# EAGLE design XTIDE-CPLD-3V3-v2_alt_routing (EAGLE 5.07)
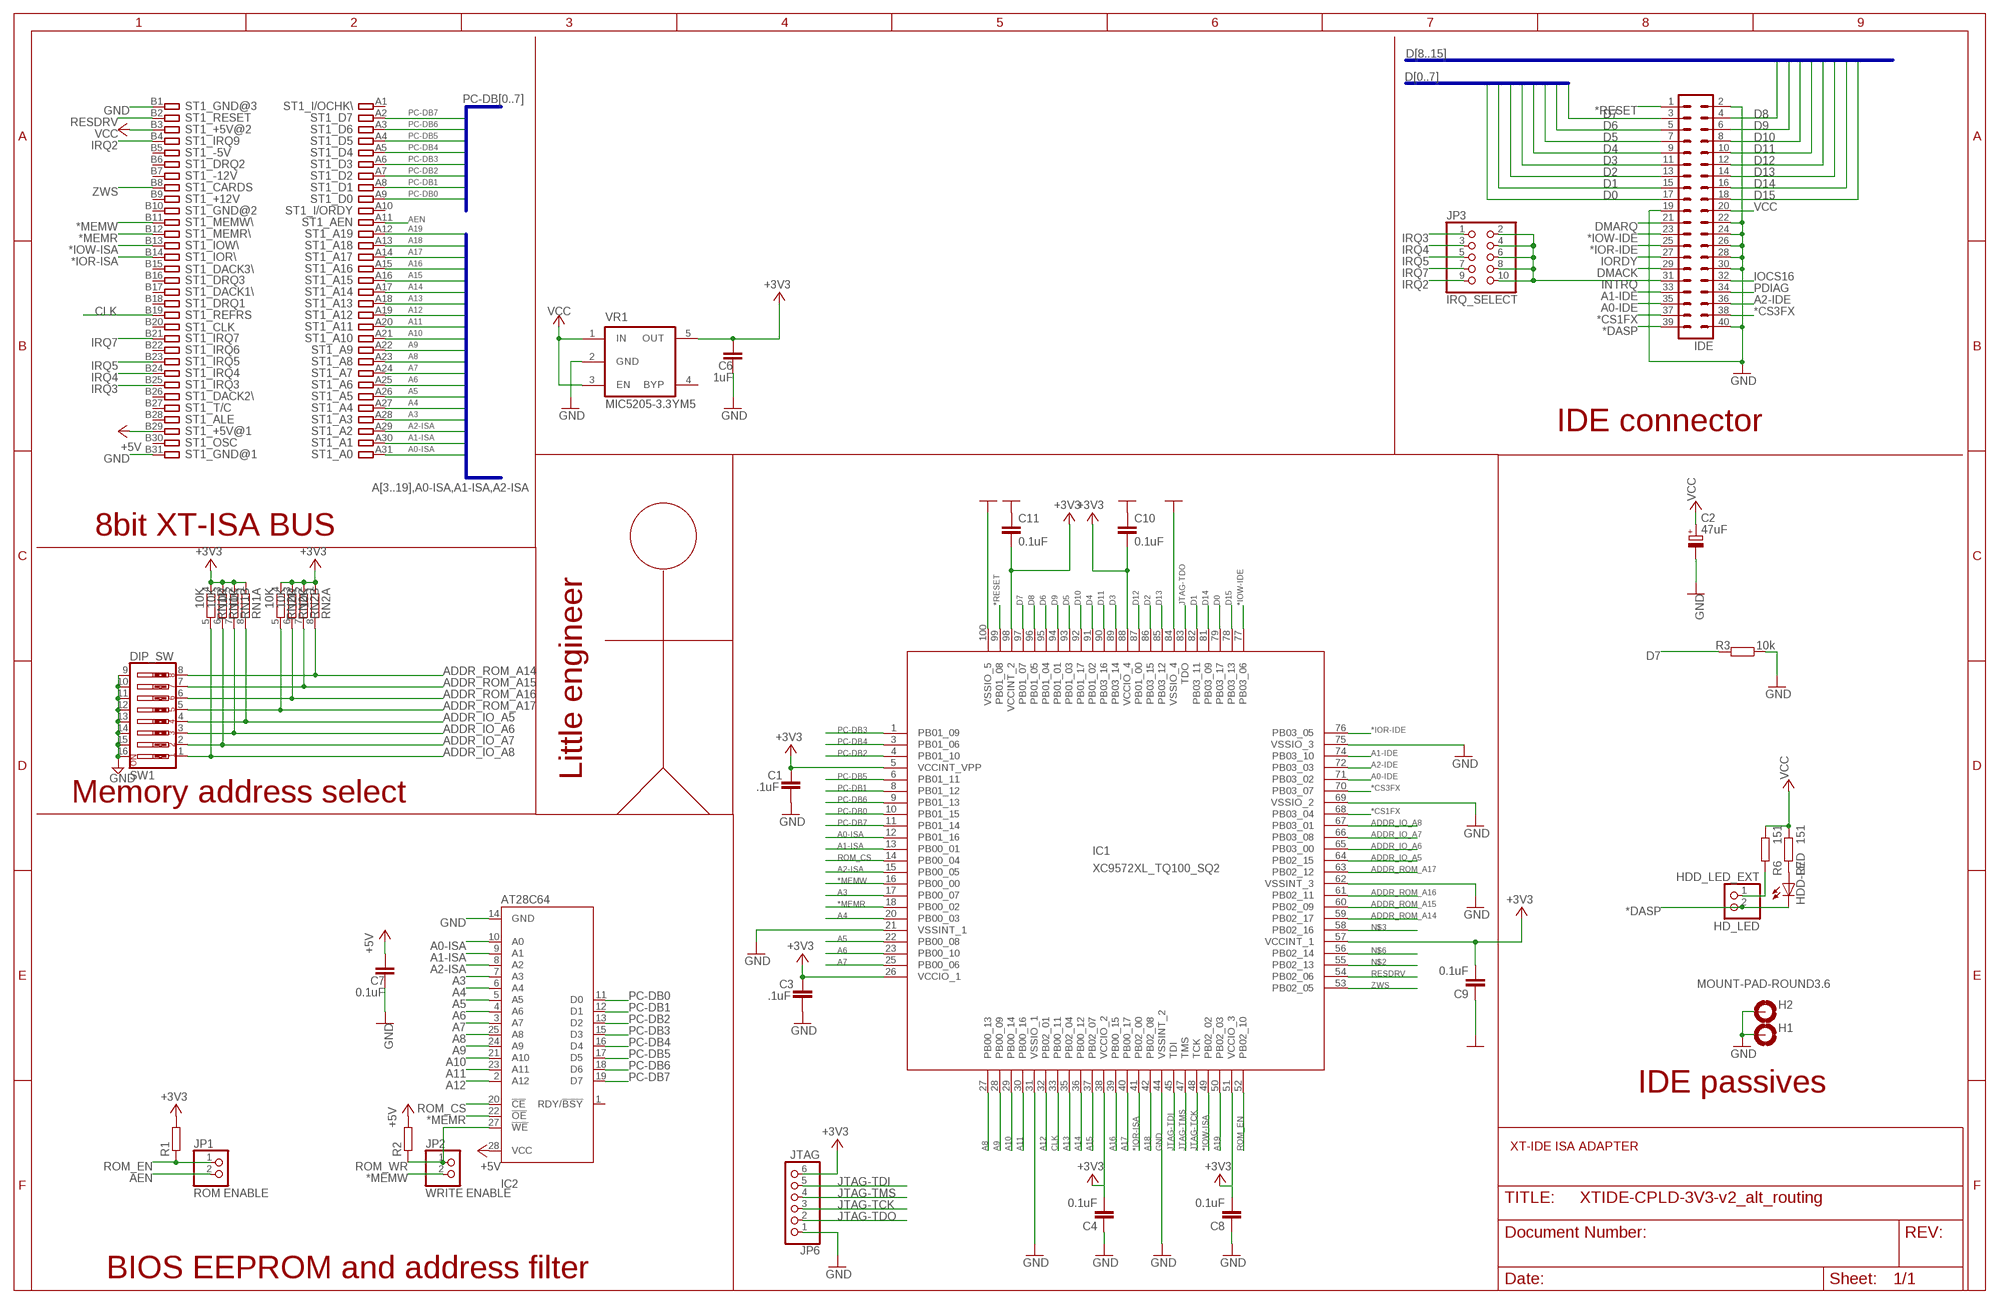
[diagram p0: schematic, sheet 1]

## Parts
C1  .1uF  C-EUC0603  [C0603]
C2  47uF  CPOL-EUSANYO_SMD_A5  [SANYO-OSCON_SMD_A5]
C3  .1uF  C-EUC0603  [C0603]
C4  0.1uF  C-EUC0603  [C0603]
C6  1uF  C-EUC0603  [C0603]
C7  0.1uF  C-EUC0603  [C0603]
C8  0.1uF  C-EUC0603  [C0603]
C9  0.1uF  C-EUC0603  [C0603]
C10  0.1uF  C-EUC0603  [C0603]
C11  0.1uF  C-EUC0603  [C0603]
DIP_SW  SW1  SW_DIP-8  [EDG-08]
H1  MOUNT-PAD-ROUND3.6  [3,6-PAD]
H2  MOUNT-PAD-ROUND3.6  [3,6-PAD]
HDD-LED  LEDCHIPLED_0805  [CHIPLED_0805]
HDD_LED_EXT  HD_LED  PINHD-1X02_2.54-S  [1X02-S]
IC1  XC9572XL_TQ100_SQ2  [VQ100]
IC2  AT28C64  28C64AP  [DIL28-6]
IDE  MA20-2  [MA20-2]
JP1  ROM ENABLE  PINHD-1X02_2.54-S  [1X02-S]
JP2  WRITE ENABLE  PINHD-1X02_2.54-S  [1X02-S]
JP3  IRQ_SELECT  PINHD-2X05_2.54  [2X05]
JP6  JTAG  PINHD-1X06_2.54-S  [1X06-S]
R1  R-EU_R0603  [R0603]
R2  R-EU_R0603  [R0603]
R3  10k  R-EU_R0603  [R0603]
R6  151  R-EU_R0603  [R0603]
R7  151  R-EU_R0603  [R0603]
RN1  10K  RNETWORK  [RN8P-4R-CRA06S]
RN2  10K  RNETWORK  [RN8P-4R-CRA06S]
ST1  IBM8BIT  [IBM8BIT]
VR1  MIC5205-3.3YM5  MIC5205  [SOT-23-5]

## Nets
*CS1FX: IC1.68(PB03_04) IDE.37
*CS3FX: IC1.70(PB03_07) IDE.38
*DASP: HDD-LED.C HDD_LED_EXT.2 IDE.39
*IOR-IDE: IC1.76(PB03_05) IDE.25
*IOR-ISA: IC1.41(PB02_00) ST1.B14
*IOW-IDE: IC1.77(PB03_06) IDE.23
*IOW-ISA: IC1.49(PB02_02) ST1.B13
*MEMR: IC1.18(PB00_02) IC2.22(!OE) ST1.B12
*MEMW: IC1.16(PB00_00) JP2.2 ST1.B11
*RESET: IC1.99(PB01_08) IDE.1
+3V3: C1.2 C3.2 C4.2 C6.2 C8.2 C9.2 C10.2 C11.2 IC1.5(VCCINT_VPP) IC1.26(VCCIO_1) IC1.38(VCCIO_2) IC1.51(VCCIO_3) IC1.57(VCCINT_1) IC1.88(VCCIO_4) IC1.98(VCCINT_2) JP6.6 R1.2 RN1.1 RN1.2 RN1.3 RN1.4 RN2.1 RN2.2 RN2.3 RN2.4 VR1.5(OUT)
+5V: C7.2 IC2.28(VCC) R2.2 ST1.B29
A0-IDE: IC1.71(PB03_02) IDE.35
A0-ISA: IC1.12(PB01_16) IC2.10(A0) ST1.A31
A1-IDE: IC1.74(PB03_10) IDE.33
A1-ISA: IC1.13(PB00_01) IC2.9(A1) ST1.A30
A2-IDE: IC1.72(PB03_03) IDE.36
A2-ISA: IC1.15(PB00_05) IC2.8(A2) ST1.A29
A3: IC1.17(PB00_07) IC2.7(A3) ST1.A28
A4: IC1.20(PB00_03) IC2.6(A4) ST1.A27
A5: IC1.22(PB00_08) IC2.5(A5) ST1.A26
A6: IC1.23(PB00_10) IC2.4(A6) ST1.A25
A7: IC1.25(PB00_06) IC2.3(A7) ST1.A24
A8: IC1.27(PB00_13) IC2.25(A8) ST1.A23
A9: IC1.28(PB00_09) IC2.24(A9) ST1.A22
A10: IC1.29(PB00_14) IC2.21(A10) ST1.A21
A11: IC1.30(PB00_16) IC2.23(A11) ST1.A20
A12: IC1.32(PB02_01) IC2.2(A12) ST1.A19
A13: IC1.35(PB02_04) ST1.A18
A14: IC1.36(PB00_12) ST1.A17
A15: IC1.37(PB02_07) ST1.A16
A16: IC1.39(PB00_15) ST1.A15
A17: IC1.40(PB00_17) ST1.A14
A18: IC1.42(PB02_08) ST1.A13
A19: IC1.50(PB02_03) ST1.A12
ADDR_IO_A5: DIP_SW.4 IC1.64(PB02_15) RN1.8
ADDR_IO_A6: DIP_SW.3 IC1.65(PB03_00) RN1.7
ADDR_IO_A7: DIP_SW.2 IC1.66(PB03_08) RN1.6
ADDR_IO_A8: DIP_SW.1 IC1.67(PB03_01) RN1.5
ADDR_ROM_A14: DIP_SW.8 IC1.59(PB02_17) RN2.8
ADDR_ROM_A15: DIP_SW.7 IC1.60(PB02_09) RN2.7
ADDR_ROM_A16: DIP_SW.6 IC1.61(PB02_11) RN2.6
ADDR_ROM_A17: DIP_SW.5 IC1.63(PB02_12) RN2.5
AEN: JP1.2 ST1.A11
CLK: IC1.33(PB00_11) ST1.B19
D0: IC1.79(PB03_17) IDE.17
D1: IC1.82(PB03_11) IDE.15
D2: IC1.86(PB03_15) IDE.13
D3: IC1.89(PB03_14) IDE.11
D4: IC1.91(PB01_02) IDE.9
D5: IC1.93(PB01_03) IDE.7
D6: IC1.95(PB01_04) IDE.5
D7: IC1.97(PB01_07) IDE.3 R3.2
D8: IC1.96(PB01_05) IDE.4
D9: IC1.94(PB01_01) IDE.6
D10: IC1.92(PB01_17) IDE.8
D11: IC1.90(PB03_16) IDE.10
D12: IC1.87(PB01_00) IDE.12
D13: IC1.85(PB03_12) IDE.14
D14: IC1.81(PB03_09) IDE.16
D15: IC1.78(PB03_13) IDE.18
DMACK: IDE.29
DMARQ: IDE.21
GND: C1.1 C2.- C3.1 C4.1 C6.1 C7.1 C8.1 C9.1 C10.1 C11.1 DIP_SW.9 DIP_SW.10 DIP_SW.11 DIP_SW.12 DIP_SW.13 DIP_SW.14 DIP_SW.15 DIP_SW.16 H1.B3,6(MOUNT) H2.B3,6(MOUNT) IC1.21(VSSINT_1) IC1.31(VSSIO_1) IC1.44(VSSINT_2) IC1.62(VSSINT_3) IC1.69(VSSIO_2) IC1.75(VSSIO_3) IC1.84(VSSIO_4) IC1.100(VSSIO_5) IC2.14(GND) IDE.2 IDE.19 IDE.22 IDE.24 IDE.26 IDE.28 IDE.30 IDE.40 JP6.1 R3.1 ST1.B1 ST1.B31 VR1.2(GND)
INTRQ: IDE.31 JP3.2 JP3.4 JP3.6 JP3.8 JP3.10
IOCS16: IDE.32
IORDY: IDE.27
IRQ2: JP3.9 ST1.B4
IRQ3: JP3.1 ST1.B25
IRQ4: JP3.3 ST1.B24
IRQ5: JP3.5 ST1.B23
IRQ7: JP3.7 ST1.B21
JTAG-TCK: IC1.48(TCK) JP6.3
JTAG-TDI: IC1.45(TDI) JP6.5
JTAG-TDO: IC1.83(TDO) JP6.2
JTAG-TMS: IC1.47(TMS) JP6.4
N$1: HDD-LED.A R7.2
N$2: IC1.55(PB02_13)
N$3: IC1.58(PB02_16)
N$5: HDD_LED_EXT.1 R6.2
N$6: IC1.56(PB02_14)
PC-DB0: IC1.10(PB01_15) IC2.11(D0) ST1.A9
PC-DB1: IC1.8(PB01_12) IC2.12(D1) ST1.A8
PC-DB2: IC1.4(PB01_10) IC2.13(D2) ST1.A7
PC-DB3: IC1.1(PB01_09) IC2.15(D3) ST1.A6
PC-DB4: IC1.3(PB01_06) IC2.16(D4) ST1.A5
PC-DB5: IC1.6(PB01_11) IC2.17(D5) ST1.A4
PC-DB6: IC1.9(PB01_13) IC2.18(D6) ST1.A3
PC-DB7: IC1.11(PB01_14) IC2.19(D7) ST1.A2
PDIAG: IDE.34
RESDRV: IC1.54(PB02_06) ST1.B2
ROM_CS: IC1.14(PB00_04) IC2.20(!CE)
ROM_EN: IC1.52(PB02_10) JP1.1 R1.1
ROM_WR: IC2.27(!WE) JP2.1 R2.1
VCC: C2.+ IDE.20 R6.1 R7.1 ST1.B3 VR1.1(IN) VR1.3(EN)
ZWS: IC1.53(PB02_05) ST1.B8
Unconnected: IC2.1(RDY/!BSY) ST1.A1 ST1.A10 ST1.B5 ST1.B6 ST1.B7 ST1.B9 ST1.B10 ST1.B15 ST1.B16 ST1.B17 ST1.B18 ST1.B20 ST1.B22 ST1.B26 ST1.B27 ST1.B28 ST1.B30 VR1.4(BYP)

## Buses
D[0..7]
D[8..15]
PC-DB[0..7]
A[3..19],A0-ISA,A1-ISA,A2-ISA

## Notes on the sheet
- IDE connector
- 8bit XT-ISA BUS
- Little engineer
- Memory address select
- IDE passives
- XT-IDE ISA ADAPTER
- BIOS EEPROM and address filter

## Library data of the parts
C1 C3 C4 C6-C11 = rcl:C-EU: CAPACITOR, European symbol
C2 = rcl:CPOL-EU: POLARIZED CAPACITOR, European symbol
DIP_SW = special:SW_DIP-8: DIP SWITCH
H1 H2 = holes:MOUNT-PAD-ROUND: MOUNTING PAD, round
HDD-LED = led:LED: LED OSRAM: - CHIPLED LG R971, LG N971, LY N971, LG Q971, LY Q971, LO R971, LY R971 LH N974, LH R974 LS Q976, LO Q976, LY Q976 LO Q996 - Hyper CHIPLED LW Q18S LB Q993, LB Q99A, LB R99A - SideLED LS A670, LO A670, LY A670, LG A670, LP A670 LB A673, LV A673, LT A673, LW A673 LH A674 LY A675 LS A676, LA A676, LO A676, LY A676, LW A676 LS A679, LY A679, LG A679 - Hyper Micro SIDELED® LS Y876, LA Y876, LO Y876, LY Y876 LT Y87S - SmartLED LW L88C, LW L88S LB L89C, LB L89S, LG L890 LS L89K, LO L89K, LY L89K LS L896, LA L896, LO L896, LY L896 - TOPLED LS T670, LO T670, LY T670, LG T670, LP T670 LSG T670, LSP T670, LSY T670, LOP T670, LYG T670 LG T671, LOG T671, LSG T671 LB T673, LV T673, LT T673, LW T673 LH T674 LS T676, LA T676, LO T676, LY T676, LB T676, LH T676, LSB T676, LW T676 LB T67C, LV T67C, LT T67C, LS T67K, LO T67K, LY T67K, LW E67C LS E67B, LA E67B, LO E67B, LY E67B, LB E67C, LV E67C, LT E67C LW T67C LS T679, LY T679, LG T679 LS T770, LO T770, LY T770, LG T770, LP T770 LB T773, LV T773, LT T773, LW T773 LH T774 LS E675, LA E675, LY E675, LS T675 LS T776, LA T776, LO T776, LY T776, LB T776 LHGB T686 LT T68C, LB T68C - Hyper Mini TOPLED® LB M676 - Mini TOPLED Santana® LG M470 LS M47K, LO M47K, LY M47K Source: http://www.osram.convergy.de LUXEON: - LUMILED® LXK2-PW12-R00, LXK2-PW12-S00, LXK2-PW14-U00, LXK2-PW14-V00 LXK2-PM12-R00, LXK2-PM12-S00, LXK2-PM14-U00 LXK2-PE12-Q00, LXK2-PE12-R00, LXK2-PE12-S00, LXK2-PE14-T00, LXK2-PE14-U00 LXK2-PB12-K00, LXK2-PB12-L00, LXK2-PB12-M00, LXK2-PB14-N00, LXK2-PB14-P00, LXK2-PB14-Q00 LXK2-PR12-L00, LXK2-PR12-M00, LXK2-PR14-Q00, LXK2-PR14-R00 LXK2-PD12-Q00, LXK2-PD12-R00, LXK2-PD12-S00 LXK2-PH12-R00, LXK2-PH12-S00 LXK2-PL12-P00, LXK2-PL12-Q00, LXK2-PL12-R00 Source: www.luxeon.com KINGBRIGHT: KA-3528ASYC Source: www.kingbright.com
HDD_LED_EXT JP1 JP2 = pinhead-2:PINHD-1X02: PIN HEADER
IC1 = dp_devices:XC9572XL_TQ100_SQ2: xc9572xl_tq100 edit this description Auto generated by make-symbol-device-package-bsdl.ulp Rev. 34 Source: xc9572xl_tq100.bsd
IC2 = microchip:28*64A: CMOS EEPROM 64 K (8 K x 8), low voltage
IDE = con-lstb:MA20-2: PIN HEADER
JP3 = pinhead-2:PINHD-2X05: PIN HEADER
JP6 = pinhead-2:PINHD-1X06: PIN HEADER
R1-R3 R6 R7 = rcl:R-EU_: RESISTOR, European symbol
RN1 RN2 = dp_devices:RNETWORK: 4 Resistor Array 0603
ST1 = con-pc:IBM8BIT: 8-bit CARD IBM/PC-AT
VR1 = dp_devices:MIC5205: 150ma Low-Noise LDO Regulator

## Board
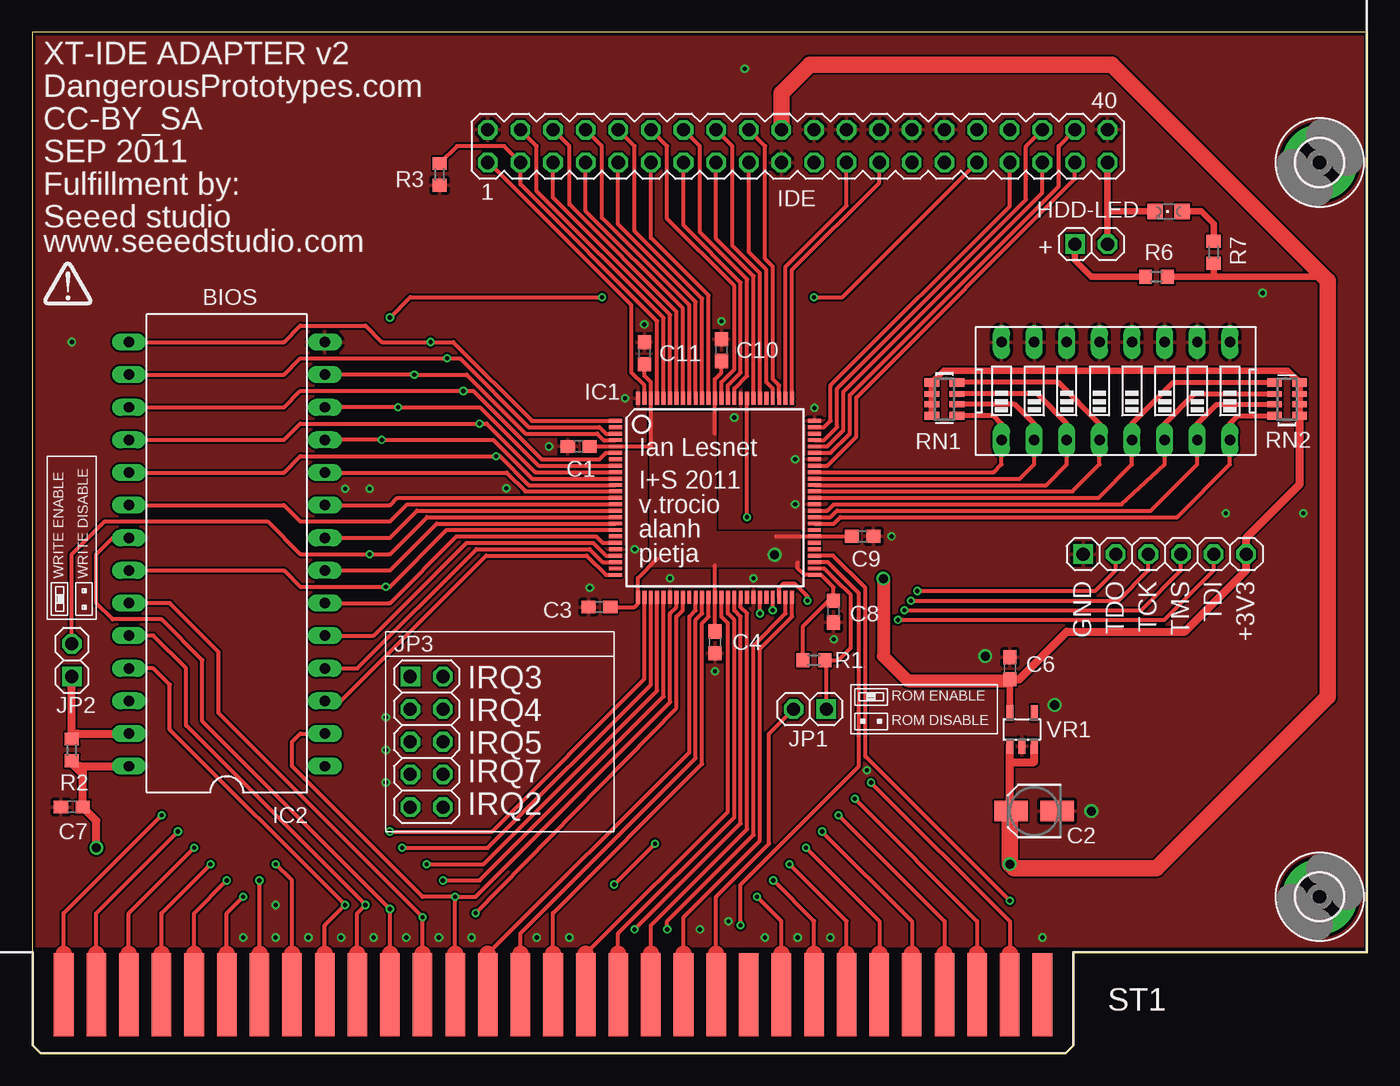
[diagram p1: board, top side]
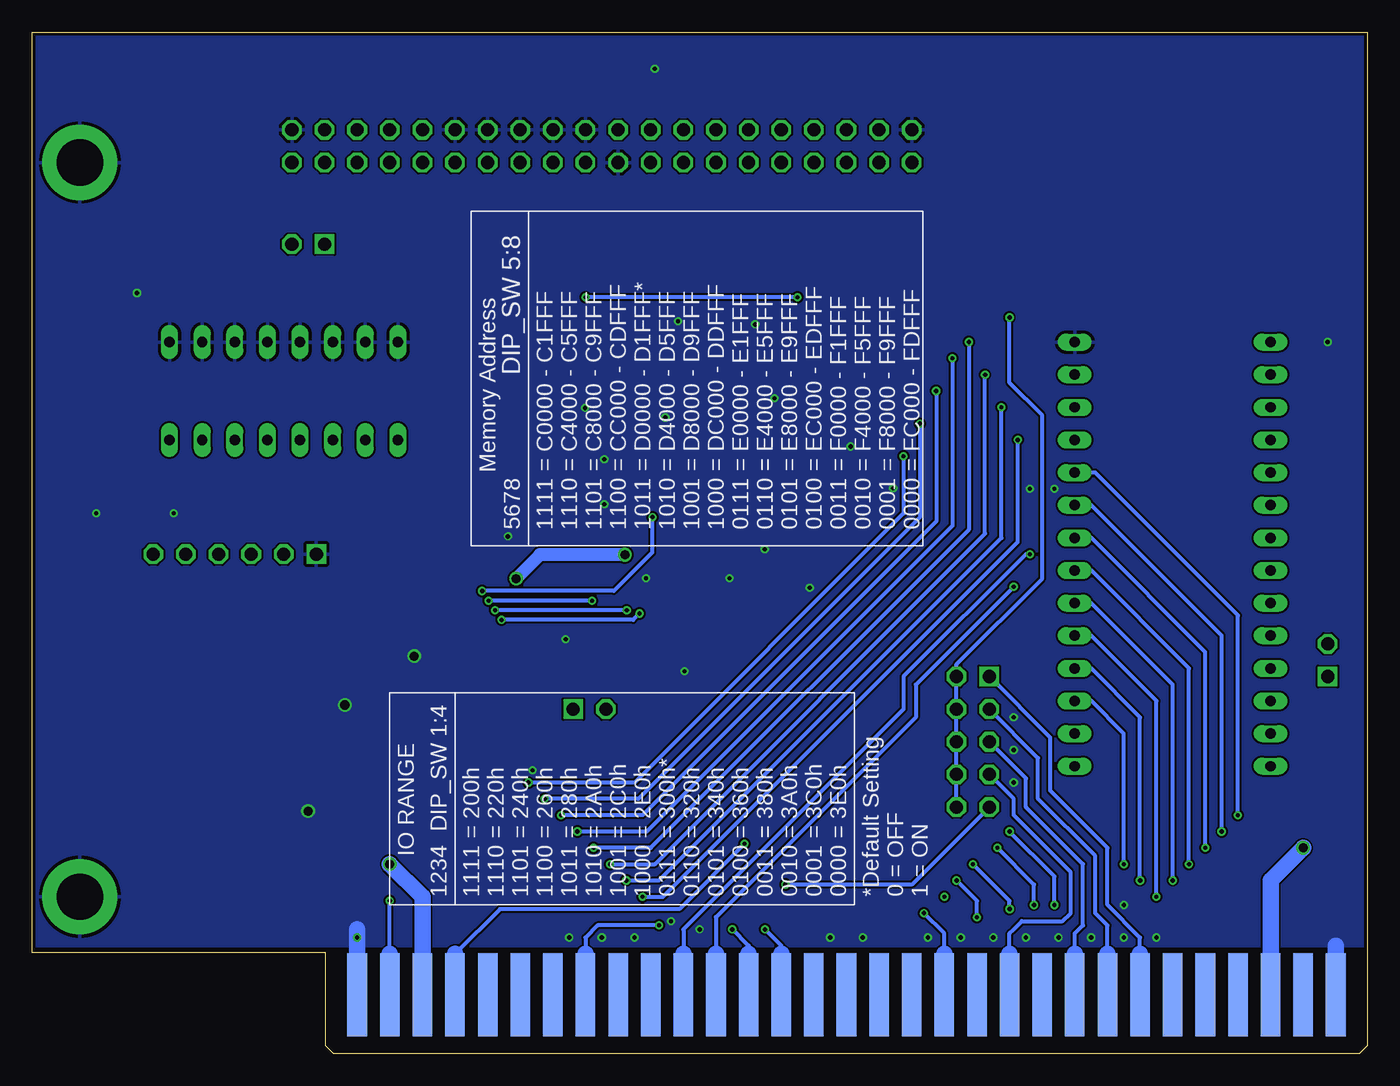
[diagram p2: board, bottom side, seen from below]

Size 103.97 x 79.52 mm. Coordinates in mm from the lower left corner, seen from the top.
Outline: 0,0.79 0,0.63 0.63,0 80.49,0 81.12,0.63 81.12,7.86 103.97,7.86 103.97,79.52 0,79.52 0,0.79
Copper layers (1*16): Top 0.035mm / dielectric 1.5mm / Bottom 0.035mm
Design rules "Fusion_eagle_rule_v1.1": minimum track width 6mil, minimum drill 12mil, track to track 6mil, track to pad 6mil, pad to pad 6mil, via to via 6mil, smd to smd 0mil, copper to edge 10mil, drill to drill 10mil, minimum pad ring 10mil, minimum via ring 6mil, stop-mask expansion 2mil, vias tented up to drill 100mil, thermal gap 10mil

### Footprints (pad centres in the part's own frame; a part is rotated, then mirrored left to right if it is on the bottom)
C0603 = smd 1.1 x 1: 1 -0.85,0; 2 0.85,0
SANYO-OSCON_SMD_A5 = smd 2.6 x 1.6: + 1.8,0; - -1.8,0
EDG-08 = drill 0.813 long: 1 -8.89,-3.81; 2 -6.35,-3.81; 3 -3.81,-3.81; 4 -1.27,-3.81; 5 1.27,-3.81; 6 3.81,-3.81; 7 6.35,-3.81; 8 8.89,-3.81; 9 8.89,3.81; 10 6.35,3.81; 11 3.81,3.81; 12 1.27,3.81; 13 -1.27,3.81; 14 -3.81,3.81; 15 -6.35,3.81; 16 -8.89,3.81
3,6-PAD = drill 3.6 pad 5.842 round: B3,6 0,0
CHIPLED_0805 = smd 1.2 x 1.2: A 0,-1.05; C 0,1.05
1X02-S = drill 1.016 square: 1 -1.27,0 | drill 1.016 octagon: 2 1.27,0
VQ100 = smd 1 x 0.3: 1 -7.75,6; 2 -7.75,5.5; 3 -7.75,5; 4 -7.75,4.5; 5 -7.75,4; 6 -7.75,3.5; 7 -7.75,3; 8 -7.75,2.5; 9 -7.75,2; 10 -7.75,1.5; 11 -7.75,1; 12 -7.75,0.5; 13 -7.75,0; 14 -7.75,-0.5; 15 -7.75,-1; 16 -7.75,-1.5; 17 -7.75,-2; 18 -7.75,-2.5; 19 -7.75,-3; 20 -7.75,-3.5; 21 -7.75,-4; 22 -7.75,-4.5; 23 -7.75,-5; 24 -7.75,-5.5; 25 -7.75,-6; 51 7.75,-6; 52 7.75,-5.5; 53 7.75,-5; 54 7.75,-4.5; 55 7.75,-4; 56 7.75,-3.5; 57 7.75,-3; 58 7.75,-2.5; 59 7.75,-2; 60 7.75,-1.5; 61 7.75,-1; 62 7.75,-0.5; 63 7.75,0; 64 7.75,0.5; 65 7.75,1; 66 7.75,1.5; 67 7.75,2; 68 7.75,2.5; 69 7.75,3; 70 7.75,3.5; 71 7.75,4; 72 7.75,4.5; 73 7.75,5; 74 7.75,5.5; 75 7.75,6 | smd 0.3 x 1: 26 -6,-7.75; 27 -5.5,-7.75; 28 -5,-7.75; 29 -4.5,-7.75; 30 -4,-7.75; 31 -3.5,-7.75; 32 -3,-7.75; 33 -2.5,-7.75; 34 -2,-7.75; 35 -1.5,-7.75; 36 -1,-7.75; 37 -0.5,-7.75; 38 0,-7.75; 39 0.5,-7.75; 40 1,-7.75; 41 1.5,-7.75; 42 2,-7.75; 43 2.5,-7.75; 44 3,-7.75; 45 3.5,-7.75; 46 4,-7.75; 47 4.5,-7.75; 48 5,-7.75; 49 5.5,-7.75; 50 6,-7.75; 76 6,7.75; 77 5.5,7.75; 78 5,7.75; 79 4.5,7.75; 80 4,7.75; 81 3.5,7.75; 82 3,7.75; 83 2.5,7.75; 84 2,7.75; 85 1.5,7.75; 86 1,7.75; 87 0.5,7.75; 88 0,7.75; 89 -0.5,7.75; 90 -1,7.75; 91 -1.5,7.75; 92 -2,7.75; 93 -2.5,7.75; 94 -3,7.75; 95 -3.5,7.75; 96 -4,7.75; 97 -4.5,7.75; 98 -5,7.75; 99 -5.5,7.75; 100 -6,7.75
DIL28-6 = drill 0.813 long: 1 -16.51,-7.62; 2 -13.97,-7.62; 3 -11.43,-7.62; 4 -8.89,-7.62; 5 -6.35,-7.62; 6 -3.81,-7.62; 7 -1.27,-7.62; 8 1.27,-7.62; 9 3.81,-7.62; 10 6.35,-7.62; 11 8.89,-7.62; 12 11.43,-7.62; 13 13.97,-7.62; 14 16.51,-7.62; 15 16.51,7.62; 16 13.97,7.62; 17 11.43,7.62; 18 8.89,7.62; 19 6.35,7.62; 20 3.81,7.62; 21 1.27,7.62; 22 -1.27,7.62; 23 -3.81,7.62; 24 -6.35,7.62; 25 -8.89,7.62; 26 -11.43,7.62; 27 -13.97,7.62; 28 -16.51,7.62
MA20-2 = drill 1.016 octagon: 1 -24.13,-1.27; 2 -24.13,1.27; 3 -21.59,-1.27; 4 -21.59,1.27; 5 -19.05,-1.27; 6 -19.05,1.27; 7 -16.51,-1.27; 8 -16.51,1.27; 9 -13.97,-1.27; 10 -13.97,1.27; 11 -11.43,-1.27; 12 -11.43,1.27; 13 -8.89,-1.27; 14 -8.89,1.27; 15 -6.35,-1.27; 16 -6.35,1.27; 17 -3.81,-1.27; 18 -3.81,1.27; 19 -1.27,-1.27; 20 -1.27,1.27; 21 1.27,-1.27; 22 1.27,1.27; 23 3.81,-1.27; 24 3.81,1.27; 25 6.35,-1.27; 26 6.35,1.27; 27 8.89,-1.27; 28 8.89,1.27; 29 11.43,-1.27; 30 11.43,1.27; 31 13.97,-1.27; 32 13.97,1.27; 33 16.51,-1.27; 34 16.51,1.27; 35 19.05,-1.27; 36 19.05,1.27; 37 21.59,-1.27; 38 21.59,1.27; 39 24.13,-1.27; 40 24.13,1.27
2X05 = drill 1.016 square: 1 -5.08,-1.27 | drill 1.016 octagon: 2 -5.08,1.27; 3 -2.54,-1.27; 4 -2.54,1.27; 5 0,-1.27; 6 0,1.27; 7 2.54,-1.27; 8 2.54,1.27; 9 5.08,-1.27; 10 5.08,1.27
1X06-S = drill 1.016 square: 1 -6.35,0 | drill 1.016 octagon: 2 -3.81,0; 3 -1.27,0; 4 1.27,0; 5 3.81,0; 6 6.35,0
R0603 = smd 1 x 1.1: 1 -0.85,0; 2 0.85,0
RN8P-4R-CRA06S = smd 0.63 x 1.15: 1 -1.295,-0.975; 4 1.295,-0.975; 5 1.295,0.975; 8 -1.295,0.975 | smd 0.44 x 1.15: 2 -0.4,-0.975; 3 0.4,-0.975; 6 0.4,0.975; 7 -0.4,0.975
IBM8BIT = smd 1.524 x 6.477: A1 -25.4,5.08; A2 -27.94,5.08; A3 -30.48,5.08; A4 -33.02,5.08; A5 -35.56,5.08; A6 -38.1,5.08; A7 -40.64,5.08; A8 -43.18,5.08; A9 -45.72,5.08; A10 -48.26,5.08; A11 -50.8,5.08; A12 -53.34,5.08; A13 -55.88,5.08; A14 -58.42,5.08; A15 -60.96,5.08; A16 -63.5,5.08; A17 -66.04,5.08; A18 -68.58,5.08; A19 -71.12,5.08; A20 -73.66,5.08; A21 -76.2,5.08; A22 -78.74,5.08; A23 -81.28,5.08; A24 -83.82,5.08; A25 -86.36,5.08; A26 -88.9,5.08; A27 -91.44,5.08; A28 -93.98,5.08; A29 -96.52,5.08; A30 -99.06,5.08; A31 -101.6,5.08 | smd 1.524 x 6.477 bottom: B1 -25.4,5.08; B2 -27.94,5.08; B3 -30.48,5.08; B4 -33.02,5.08; B5 -35.56,5.08; B6 -38.1,5.08; B7 -40.64,5.08; B8 -43.18,5.08; B9 -45.72,5.08; B10 -48.26,5.08; B11 -50.8,5.08; B12 -53.34,5.08; B13 -55.88,5.08; B14 -58.42,5.08; B15 -60.96,5.08; B16 -63.5,5.08; B17 -66.04,5.08; B18 -68.58,5.08; B19 -71.12,5.08; B20 -73.66,5.08; B21 -76.2,5.08; B22 -78.74,5.08; B23 -81.28,5.08; B24 -83.82,5.08; B25 -86.36,5.08; B26 -88.9,5.08; B27 -91.44,5.08; B28 -93.98,5.08; B29 -96.52,5.08; B30 -99.06,5.08; B31 -101.6,5.08
SOT-23-5 = smd 0.55 x 1.2: 1 -0.95,-1.3; 2 0,-1.3; 3 0.95,-1.3; 4 0.95,1.3; 5 -0.95,1.3

### Placement (x,y rotation side)
C1  42.56,47.27 0 top
C2  78.03,18.89 180 top
C3  44.17,34.77 0 top
C4  53.17,32.02 90 top
C6  76.12,30 270 top
C7  3.1,19.21 0 top
C8  62.4,34.42 90 top
C9  64.67,40.27 180 top
C10  53.67,54.77 270 top
C11  47.67,54.52 270 top
DIP_SW  84.38,51.59 0 top
H1  100.25,12.22 0 top
H2  100.25,69.37 0 top
HDD-LED  88.5,65.56 90 top
HDD_LED_EXT  82.47,63.02 0 top
IC1  53.17,43.27 0 top
IC2  15.16,38.89 90 top
IDE  59.61,70.64 0 top
JP1  60.56,26.83 180 top
JP2  3.1,30.64 90 top
JP3  30.72,24.29 270 top
JP6  88.19,38.89 0 top
R1  60.88,30.64 180 top
R2  3.1,23.65 270 top
R3  31.74,68.45 90 top
R6  87.55,60.48 180 top
R7  92,62.39 90 top
RN1  71.04,50.96 270 top
RN2  97.71,50.96 90 top
ST1  104.06,-0.48 0 top
U$1  [JUMP2_DESC_ON]  65.33,27.78 0 top
U$2  [JUMP2_DESC_OFF]  65.33,25.88 0 top
U$4  [JUMP2_DESC_OFF]  4.05,35.4 90 top
U$9  [DP-LOGO_TOP]  0.87,58.26 0 top
VR1  77.07,25.24 0 top
WRITE_ENABLE1  [JUMP2_DESC_ON]  2.14,35.4 90 top

### Tracks (layer width: path | path; a pad name or v marks a point on that pad's centre or on a via)
*CS1FX
  Top 0.305: IC1.68 61.92,45.77 64.17,48.02 64.17,51.07 81.2,68.1 IDE.37
*CS3FX
  Top 0.305: IC1.70 62.17,46.77 63.67,48.27 63.67,51.27 79.93,67.53 79.93,70.64 IDE.38
*DASP
  Top 0.508: 83.74,65.56 HDD-LED.C | HDD_LED_EXT.2 83.74,65.56 | 83.74,65.56 IDE.39
*IOR-IDE
  Top 0.305: IC1.76 59.17,61.02 65.96,67.81 IDE.25
*IOR-ISA  (via drill 0.33)
  Top 0.305: IC1.41 54.67,34.52 55.17,34.02 55.17,17.94 v46.91,9.68
  Bottom 0.305: 45.64,7.78 45.64,8.41 v46.91,9.68
  Bottom 1.27: ST1.B14 45.64,7.78
*IOW-IDE
  Top 0.305: IC1.77 58.67,61.27 63.42,66.02 IDE.23
*IOW-ISA  (via drill 0.33)
  Top 0.305: IC1.49 58.67,34.27 56.17,31.77 56.17,17.04 49.45,10.32 v49.45,9.68
  Bottom 0.305: 48.18,7.78 48.18,8.41 v49.45,9.68
  Bottom 1.27: ST1.B13 48.18,7.78
*MEMR  (via drill 0.33)
  Top 0.305: IC2.22 19.61,37.62 20.88,36.35 v27.54,36.35 27.86,36.35 32.28,40.77 IC1.18
  Bottom 0.305: v27.54,36.35 35.16,28.73 35.16,26.19 50.72,10.64 50.72,7.78
  Bottom 1.27: 50.72,7.78 ST1.B12
*MEMW  (via drill 0.33)
  Top 0.305: JP2.2 3.1,38.89 5.64,41.43 18.34,41.43 20.88,38.89 v26.27,38.89 27.86,38.89 30.74,41.77 IC1.16
  Bottom 0.305: v26.27,38.89 26.59,38.89 36.12,29.37 36.12,26.83 53.26,9.68 53.26,7.78
  Bottom 1.27: 53.26,7.78 ST1.B11
*RESET
  Top 0.305: IC1.99 47.67,52.02 46.67,53.02 46.67,58.27 35.57,69.37 IDE.1
+3V3  (via drill 0.71)
  Top 0.305: C1.2 IC1.5 48.17,47.27 IC1.98 48.17,52.27 47.67,52.77 C11.2 | C4.2 IC1.38 53.17,38.02 | C3.2 46.92,34.77 47.17,35.02 IC1.26 47.17,37.02 48.67,38.52 | 57.92,40.27 IC1.57 C9.2 | 53.17,48.27 IC1.88 53.17,52.52 53.67,53.02 C10.2 | 59.61,38.26 59.61,37.79 60.12,37.27 IC1.51 61.42,37.27 62.4,36.3 C8.2 62.02,35.27 60.03,33.28 R1.2
  Top 0.508: RN1.4 RN1.3 RN1.2 RN1.1 70.99,53.18 97.76,53.18 RN2.4 RN2.3 RN2.2 RN2.1 | C6.2 VR1.5
  Top 0.61: C6.2 76.86,29.15 80.57,32.86 89.77,32.86 94.54,37.62 JP6.6 94.54,40.16 98.69,44.31 RN2.1
  Top 1.016: v66.28,36.99 66.28,30.96 68.18,29.05 76.02,29.05 C6.2
  Bottom 1.016: v57.81,38.85 64.42,38.85 v66.28,36.99
  pour Top: 48.17,49.77 48.17,38.02 59.69,38.02 59.69,40.52 53.17,40.52 53.17,49.77
+5V  (via drill 0.71)
  Top 0.406: 3.62,22.28 3.73,22.38 | 3.1,22.6 R2.2
  Top 0.61: v5,16.03 5,18.15 C7.2 3.95,21.75 | 3.95,21.75 3.95,21.95 3.62,22.28 3.52,22.38 | 3.73,22.38 IC2.28 | 3.95,21.75 3.1,22.6
  Bottom 1.27: v5,16.03 7.54,13.49 ST1.B29
A0-IDE
  Top 0.305: IC1.71 61.92,47.27 63.17,48.52 63.17,51.52 78.66,67.01 IDE.35
A0-ISA  (via drill 0.33)
  Top 0.305: v10.08,18.57 2.46,10.95 2.46,7.78 | IC1.12 38.42,43.77 36.95,45.24 IC2.10
  Top 1.27: ST1.A31 2.46,7.78
  Bottom 0.305: IC2.10 21.19,45.24 10.08,34.13 v10.08,18.57
A1-IDE
  Top 0.305: IC1.74 61.67,48.77 62.17,49.27 62.17,52.02 76.12,65.97 IDE.33
A1-ISA  (via drill 0.33)
  Top 0.305: v11.35,17.3 5,10.95 5,7.78 | IC2.9 27.86,42.7 28.43,43.27 IC1.13
  Top 1.27: ST1.A30 5,7.78
  Bottom 0.305: IC2.9 21.51,42.7 11.35,32.54 v11.35,17.3
A2-IDE
  Top 0.305: IC1.72 61.67,47.77 62.67,48.77 62.67,51.77 77.39,66.49 77.39,68.1 77.39,68.27 77.39,70.64 IDE.36
A2-ISA  (via drill 0.33)
  Top 0.305: v12.62,16.03 7.54,10.95 7.54,7.78 | IC2.8 27.86,40.16 29.97,42.27 IC1.15
  Top 1.27: ST1.A29 7.54,7.78
  Bottom 0.305: IC2.8 21.51,40.16 12.62,31.27 v12.62,16.03
A3  (via drill 0.33)
  Top 0.305: v13.89,14.76 10.08,10.95 10.08,7.78 | IC2.7 27.86,37.62 31.51,41.27 IC1.17
  Top 1.27: ST1.A28 10.08,7.78
  Bottom 0.305: IC2.7 21.51,37.62 13.89,30 v13.89,14.76
A4  (via drill 0.33)
  Top 0.305: v15.16,13.49 12.62,10.95 12.62,7.78 | IC2.6 27.86,35.08 33.05,40.27 43.92,40.27 44.42,39.77 IC1.20
  Top 1.27: ST1.A27 12.62,7.78
  Bottom 0.305: IC2.6 21.51,35.08 15.16,28.73 v15.16,13.49
A5  (via drill 0.33)
  Top 0.305: v16.43,12.22 15.16,10.95 15.16,7.78 | IC2.5 26.59,32.54 33.82,39.77 43.67,39.77 44.67,38.77 IC1.22
  Top 1.27: ST1.A26 15.16,7.78
  Bottom 0.305: IC2.5 21.51,32.54 16.43,27.46 v16.43,12.22
A6  (via drill 0.33)
  Top 0.305: IC2.4 25.32,30 34.59,39.27 43.42,39.27 44.42,38.27 IC1.23 | 17.7,7.78 v17.7,13.49
  Top 1.27: ST1.A25 17.7,7.78
  Bottom 0.305: IC2.4 21.51,30 17.7,26.19 v17.7,13.49
A7  (via drill 0.33)
  Top 0.305: v18.97,14.76 20.24,13.49 20.24,7.78 | IC2.3 24.05,27.46 35.36,38.77 43.17,38.77 44.67,37.27 IC1.25
  Top 1.27: ST1.A24 20.24,7.78
  Bottom 0.305: IC2.3 21.51,27.46 18.97,24.92 v18.97,14.76
A8  (via drill 0.33)
  Top 0.305: IC2.25 9.45,30 10.72,28.73 10.72,25.24 v24.37,11.59 22.78,10 22.78,7.78 | v27.86,17.3 35.8,17.3 47.67,29.18 IC1.27
  Top 1.27: ST1.A23 22.78,7.78
  Bottom 0.305: v24.37,11.59 24.37,13.81 v27.86,17.3
A9  (via drill 0.33)
  Top 0.305: IC2.24 9.45,32.54 11.99,30 11.99,25.56 v25.96,11.59 25.32,10.95 25.32,7.78 | v28.81,16.03 35.48,16.03 48.17,28.72 IC1.28
  Top 1.27: ST1.A22 25.32,7.78
  Bottom 0.305: v25.96,11.59 25.96,13.18 v28.81,16.03
A10  (via drill 0.33)
  Top 0.305: IC2.21 6.27,40.16 5,38.89 5,35.08 6.27,33.81 10.08,33.81 13.26,30.64 13.26,25.88 v27.86,11.27 27.86,7.78 | v30.72,14.76 35.16,14.76 48.67,28.27 IC1.29
  Top 1.27: ST1.A21 27.86,7.78
  Bottom 0.305: v27.86,11.27 27.86,11.91 v30.72,14.76
A11  (via drill 0.33)
  Top 0.305: IC2.23 10.72,35.08 14.53,31.27 14.53,26.51 v30.4,10.64 30.4,7.78 | v31.99,13.49 34.85,13.49 49.17,27.82 IC1.30
  Top 1.27: ST1.A20 30.4,7.78
  Bottom 0.305: v30.4,10.64 30.4,11.91 v31.99,13.49
A12  (via drill 0.33)
  Top 0.305: IC2.2 20.88,24.92 20.24,24.29 20.24,22.38 30.4,12.22 v32.94,12.22 | IC1.32 50.17,34.77 49.67,34.27 49.67,27.37 34.53,12.22 v32.94,12.22 | 32.94,7.78 v32.94,12.22
  Top 1.27: ST1.A19 32.94,7.78
A13
  Top 0.305: IC1.35 51.67,34.52 51.17,34.02 51.17,23.47 35.48,7.78
  Top 1.27: ST1.A18 35.48,7.78
A14
  Top 0.305: IC1.36 52.17,34.27 51.67,33.77 51.67,23.02 38.02,9.37 38.02,7.78
  Top 1.27: ST1.A17 38.02,7.78
A15
  Top 0.305: IC1.37 52.67,34.02 52.17,33.52 52.17,22.56 40.56,10.95 40.56,7.78
  Top 1.27: ST1.A16 40.56,7.78
A16
  Top 0.305: IC1.39 53.67,34.02 54.17,33.52 54.17,18.85 43.1,7.78
  Top 1.27: ST1.A15 43.1,7.78
A17
  Top 0.305: IC1.40 54.17,34.27 54.67,33.77 54.67,18.4 45.64,9.37 45.64,7.78
  Top 1.27: ST1.A14 45.64,7.78
A18
  Top 0.305: IC1.42 55.17,34.77 55.67,34.27 55.67,17.49 48.18,10 48.18,7.78
  Top 1.27: ST1.A13 48.18,7.78
A19
  Top 0.305: IC1.50 59.17,34.02 56.67,31.52 56.67,16.59 50.72,10.64 50.72,7.78
  Top 1.27: ST1.A12 50.72,7.78
ADDR_IO_A5
  Top 0.305: DIP_SW.4 83.11,45.88 81,43.77 IC1.64
  Top 0.406: DIP_SW.4 83.11,49.05 79.91,52.25 RN1.8
ADDR_IO_A6
  Top 0.305: DIP_SW.3 80.57,45.88 78.96,44.27 IC1.65
  Top 0.406: DIP_SW.3 80.57,49.05 78.26,51.36 RN1.7
ADDR_IO_A7
  Top 0.305: DIP_SW.2 78.03,45.88 76.92,44.77 IC1.66
  Top 0.406: DIP_SW.2 78.03,49.05 76.52,50.56 RN1.6
ADDR_IO_A8
  Top 0.305: DIP_SW.1 75.49,45.88 74.88,45.27 IC1.67
  Top 0.406: DIP_SW.1 75.49,49.05 74.88,49.66 RN1.5
ADDR_ROM_A14
  Top 0.305: DIP_SW.8 93.27,45.88 89.16,41.77 62.92,41.77 62.42,41.27 IC1.59
  Top 0.406: DIP_SW.8 93.27,49.05 93.88,49.66 RN2.8
ADDR_ROM_A15
  Top 0.305: DIP_SW.7 90.73,45.88 87.12,42.27 62.67,42.27 62.17,41.77 IC1.60
  Top 0.406: DIP_SW.7 90.73,49.05 92.23,50.56 RN2.7
ADDR_ROM_A16
  Top 0.305: DIP_SW.6 88.19,45.88 84.83,42.77 62.42,42.77 61.92,42.27 IC1.61
  Top 0.406: DIP_SW.6 88.19,49.05 90.49,51.36 RN2.6
ADDR_ROM_A17
  Top 0.305: DIP_SW.5 85.65,45.88 83.04,43.27 IC1.63
  Top 0.406: DIP_SW.5 85.65,49.05 88.85,52.25 RN2.5
AEN
  Top 0.305: 53.26,7.78 53.26,12.22 57.39,16.35 57.39,24.92 JP1.2
  Top 1.27: ST1.A11 53.26,7.78
CLK  (via drill 0.33)
  Top 0.305: IC1.33 50.67,34.52 50.17,34.02 50.17,26.91 v34.53,10.95
  Bottom 0.305: v34.53,10.95 32.94,9.37 32.94,7.78
  Bottom 1.27: ST1.B19 32.94,7.78
D0
  Top 0.305: IC1.79 57.67,51.77 57.17,52.27 57.17,61.02 55.8,62.39 IDE.17
D1
  Top 0.305: IC1.82 56.17,60.52 53.26,63.43 IDE.15
D2
  Top 0.305: IC1.86 54.17,52.02 55.17,53.02 55.17,60.02 50.72,64.47 IDE.13
D3
  Top 0.305: IC1.89 52.67,59.02 48.18,63.51 IDE.11
D4
  Top 0.305: IC1.91 51.67,58.52 45.64,64.55 IDE.9
D5
  Top 0.305: IC1.93 50.67,58.02 43.1,65.59 IDE.7
D6
  Top 0.305: IDE.5 40.56,68.27 40.56,68.1 40.56,66.63 49.67,57.52 IC1.95
D7
  Top 0.305: IC1.97 48.67,57.02 38.02,67.67 IDE.3 36.75,70.64 33.08,70.64 R3.2
D8
  Top 0.305: IDE.4 39.29,70.64 39.29,67.15 49.17,57.27 IC1.96
D9
  Top 0.305: IDE.6 41.83,70.64 41.83,66.11 50.17,57.77 IC1.94
D10
  Top 0.305: IDE.8 44.37,70.64 44.37,65.07 51.17,58.27 IC1.92
D11
  Top 0.305: IDE.10 46.91,70.64 46.91,64.03 52.17,58.77 IC1.90
D12
  Top 0.305: IC1.87 53.67,52.27 54.67,53.27 54.67,59.77 49.45,64.99 49.45,70.64 IDE.12
D13
  Top 0.305: IC1.85 54.67,51.77 55.67,52.77 55.67,60.27 51.99,63.95 51.99,70.64 IDE.14
D14
  Top 0.305: IDE.16 54.53,70.64 54.53,62.91 56.67,60.77 IC1.81
D15
  Top 0.305: IDE.18 57.07,70.64 57.07,61.87 57.67,61.27 57.67,52.52 58.17,52.02 IC1.78
GND  (via drill 0.33, 0.71)
  Bottom 1.27: ST1.B31 2.46,8.41 | ST1.B1 78.66,9.68
  other vias: 40.24,47.27 46.92,39.27 21.51,9.05 24.05,9.05 26.59,9.05 29.13,9.05 31.67,9.05 34.21,9.05 53.17,29.77 49.67,37.02 56.17,37.02 62.42,32.27 59.42,42.77 59.42,46.27 60.92,50.27 66.92,40.27 43.42,36.27 54.67,49.52 53.67,57.02 47.67,56.77 46.17,51.02 74.22,30.96 79.61,27.15 82.47,18.89 36.92,44.02 41.83,9.05 51.99,9.68 18.97,9.05 16.43,9.05 27.54,26.19 27.54,23.65 27.54,21.11 18.97,11.59 65.01,22.07 57.07,9.05 59.61,9.05 62.15,9.05 54.21,10.32 26.27,43.97 24.37,43.97 98.98,42.07 92.95,42.07 95.81,59.21 55.48,76.68 3.1,55.4 39.29,9.05 78.66,9.05
  pour Top (rank 6): 0,79.52 103.97,79.52 103.97,8.41 0,8.41
  pour Bottom: 0,8.41 0,79.52 103.97,79.52 103.97,8.41
INTRQ  (via drill 0.33)
  Top 0.305: v27.86,57.31 29.45,58.9 v44.37,58.9 | v60.88,58.9 63.1,58.9 IDE.31
  Bottom 0.305: v27.86,57.31 27.86,52.23 25.32,49.69 25.32,36.99 31.99,30.32 JP3.2 JP3.4 JP3.6 | v44.37,58.9 v60.88,58.9 | JP3.10 JP3.8 JP3.6 | JP3.6 31.99,24.61
IRQ2  (via drill 0.33)
  Top 0.305: v45.32,13.18 v48.5,16.35
  Bottom 0.305: 71.04,7.78 67.55,11.27 53.58,11.27 v48.5,16.35 | JP3.9 35.48,13.18 v45.32,13.18
  Bottom 1.27: 71.04,7.78 ST1.B4
IRQ3
  Bottom 0.305: 17.7,7.78 17.7,9.05 20.24,11.59 20.24,16.03 24.69,20.48 24.69,24.61 JP3.1
  Bottom 1.27: ST1.B25 17.7,7.78
IRQ4
  Bottom 0.305: 20.24,7.78 20.24,10 21.19,10.95 21.19,15.4 25.64,19.84 25.64,23.02 JP3.3
  Bottom 1.27: ST1.B24 20.24,7.78
IRQ5
  Bottom 0.305: 22.78,7.78 22.78,9.37 22.15,10 22.15,14.76 26.59,19.21 26.59,21.43 JP3.5
  Bottom 1.27: ST1.B23 22.78,7.78
IRQ7
  Bottom 0.305: 27.86,7.78 27.86,9.37 27.54,9.68 26.91,10.32 23.73,10.32 23.1,10.95 23.1,14.13 27.54,18.57 27.54,19.84 JP3.7
  Bottom 1.27: ST1.B21 27.86,7.78
JTAG-TCK  (via drill 0.33)
  Top 0.305: IC1.48 58.17,36.27 58.51,36.61 59.35,36.61 60.25,35.72 60.38,35.59 v60.38,35.27 | v68.42,35.27 84.57,35.27 86.92,37.62 JP6.3
  Bottom 0.305: v60.38,35.27 v68.42,35.27
JTAG-TDI  (via drill 0.33)
  Top 0.305: v56.67,34.27 IC1.45 | v67.42,33.77 88.15,33.77 92,37.62 JP6.5
  Bottom 0.305: v56.67,34.27 57.17,33.77 v67.42,33.77
JTAG-TDO  (via drill 0.33)
  Top 0.305: v55.67,41.77 IC1.83 | v68.92,36.02 82.78,36.02 84.38,37.62 JP6.2
  Bottom 0.305: v68.92,36.02 58.67,36.02 55.67,39.02 v55.67,41.77
JTAG-TMS  (via drill 0.33)
  Top 0.305: v57.67,34.52 IC1.47 | v67.92,34.52 86.36,34.52 89.46,37.62 JP6.4
  Bottom 0.305: v57.67,34.52 v67.92,34.52
N$1
  Top 0.508: HDD-LED.A 91.04,65.56 92,64.61 R7.2
N$5
  Top 0.508: R6.2 82.47,60.48 81.2,61.75 HDD_LED_EXT.1
PC-DB0  (via drill 0.33)
  Top 0.305: IC2.11 v27.23,47.78 35.91,47.78 38.92,44.77 IC1.10 | 58.34,7.78 58.34,10.32 v56.44,12.22
  Top 1.27: ST1.A9 58.34,7.78
  Bottom 0.305: v27.23,47.78 27.23,39.85 54.85,12.22 v56.44,12.22
PC-DB1  (via drill 0.33)
  Top 0.305: IC2.12 v28.5,50.32 34.87,50.32 39.42,45.77 IC1.8 | 60.88,7.78 60.88,10.32 v57.71,13.49
  Top 1.27: ST1.A8 60.88,7.78
  Bottom 0.305: v28.5,50.32 28.5,40.16 55.17,13.49 v57.71,13.49
PC-DB2  (via drill 0.33)
  Top 0.305: IC2.13 v29.77,52.86 33.83,52.86 38.42,48.27 43.99,48.27 44.49,47.77 IC1.4 | 63.42,7.78 63.42,10.32 v58.98,14.76
  Top 1.27: ST1.A7 63.42,7.78
  Bottom 0.305: v29.77,52.86 29.77,40.48 55.48,14.76 v58.98,14.76
PC-DB3  (via drill 0.33)
  Top 0.305: IC2.15 19.61,55.4 20.88,56.67 25.96,56.67 27.23,55.4 v31.04,55.4 32.79,55.4 38.92,49.27 IC1.1 | v60.25,16.03 65.96,10.32 65.96,7.78
  Top 1.27: 65.96,7.78 ST1.A6
  Bottom 0.305: v31.04,55.4 31.04,40.8 55.8,16.03 v60.25,16.03
PC-DB4  (via drill 0.33)
  Top 0.305: IC1.3 44.67,48.27 44.17,48.77 38.67,48.77 33.31,54.13 v32.31,54.13 20.88,54.13 19.61,52.86 IC2.16 | v61.52,17.3 68.5,10.32 68.5,7.78
  Top 1.27: 68.5,7.78 ST1.A5
  Bottom 0.305: v32.31,54.13 32.31,41.12 56.12,17.3 v61.52,17.3
PC-DB5  (via drill 0.33)
  Top 0.305: IC2.17 19.61,50.32 20.88,51.59 v33.58,51.59 34.35,51.59 39.67,46.27 44.17,46.27 44.67,46.77 IC1.6 | v62.79,18.57 71.04,10.32 71.04,7.78
  Top 1.27: 71.04,7.78 ST1.A4
  Bottom 0.305: v33.58,51.59 33.58,41.43 56.44,18.57 v62.79,18.57
PC-DB6  (via drill 0.33)
  Top 0.305: IC2.18 19.61,47.78 20.88,49.05 v34.85,49.05 | IC1.9 39.17,45.27 35.39,49.05 v34.85,49.05 | v64.06,19.84 73.58,10.32 73.58,7.78 | v34.85,49.05 35.14,49.05
  Top 1.27: 73.58,7.78 ST1.A3
  Bottom 0.305: v34.85,49.05 34.85,41.75 56.75,19.84 v64.06,19.84
PC-DB7  (via drill 0.33)
  Top 0.305: IC2.19 19.61,45.24 20.88,46.51 v36.12,46.51 | IC1.11 38.67,44.27 36.43,46.51 v36.12,46.51 | v65.33,21.11 76.12,10.32 76.12,7.78 | v36.12,46.51 36.16,46.51 | v36.12,46.51 36.18,46.51
  Top 1.27: 76.12,7.78 ST1.A2
  Bottom 0.305: v36.12,46.51 36.12,42.07 57.07,21.11 v65.33,21.11
RESDRV  (via drill 0.33)
  Top 0.305: v76.12,11.91 64.87,23.15 64.87,36.27 62.37,38.77 IC1.54
  Bottom 0.305: 76.12,7.78 v76.12,11.91
  Bottom 1.27: ST1.B2 76.12,7.78
ROM_CS
  Top 0.305: IC2.20 19.61,42.7 20.88,41.43 27.86,41.43 29.2,42.77 IC1.14
ROM_EN
  Top 0.305: IC1.52 61.68,37.77 62.63,36.83 | 62.63,36.83 | 62.63,36.83 63.74,35.72 63.74,31.59 62.79,30.64 R1.1 61.83,30.54 JP1.1
ROM_WR
  Top 0.61: IC2.27 3.52,24.92 R2.1 JP2.1
VCC  (via drill 0.71)
  Top 0.508: 78.02,23.97 VR1.3 | 92,60.48 100.89,60.48 100.89,60.17 | 92,60.48 R6.1 | 92,60.48 R7.1
  Top 0.61: 76.12,22.7 76.12,18.99 C2.+ | 76.12,22.7 VR1.1 | 78.02,23.97 78.03,22.7 76.12,22.7
  Top 1.27: C2.+ 76.12,18.79 v76.12,14.76 76.44,14.45 87.55,14.45 100.89,27.78 100.89,60.17 84.06,76.99 60.56,76.99 58.34,74.77 IDE.20
  Bottom 1.27: ST1.B3 73.58,12.22 v76.12,14.76
ZWS  (via drill 0.33)
  Top 0.305: v55.17,10 55.17,13.18 64.37,22.38 64.37,35.86 61.96,38.27 IC1.53
  Bottom 0.305: 60.88,7.78 60.88,9.05 59.93,10 v55.17,10
  Bottom 1.27: 60.88,7.78 ST1.B8

### Text on the board
tPlace: XT-IDE ADAPTER v2 | DangerousPrototypes.com | CC-BY_SA | SEP 2011 | Fulfillment by: | Seeed studio | www.seeedstudio.com | + | Ian Lesnet | I+S 2011 | v.trocio | alanh | pietja
bPlace: DIP_SW 5:8 | Memory Address | 0000 = FC000 - FDFFF | 0001 = F8000 - F9FFF | 0010 = F4000 - F5FFF | 0011 = F0000 - F1FFF | 0100 = EC000 - EDFFF | 0101 = E8000 - E9FFF | 0110 = E4000 - E5FFF | 0111 = E0000 - E1FFF | 1000 = DC000 - DDFFF | 1001 = D8000 - D9FFF | 1010 = D4000 - D5FFF | 1011 = D0000 - D1FFF* | 1100 = CC000 - CDFFF | 1101 = C8000 - C9FFF | 1110 = C4000 - C5FFF | 1111 = C0000 - C1FFF | 5678 | DIP_SW 1:4 | IO RANGE | 1 = ON | 0 = OFF | *Default Setting | 0000 = 3E0h | 0001 = 3C0h | 0010 = 3A0h | 0011 = 380h | 0100 = 360h | 0101 = 340h | 0110 = 320h | 0111 = 300h* | 1000 = 2E0h | 1001 = 2C0h | 1010 = 2A0h | 1011 = 280h | 1100 = 260h | 1101 = 240h | 1110 = 220h | 1111 = 200h | 1234
tNames: BIOS | WRITE ENABLE | WRITE DISABLE | GND | TDO | TCK | TMS | TDI | +3V3 | IRQ3 | ROM ENABLE | IRQ4 | ROM DISABLE | IRQ5 | IRQ7 | IRQ2
Reference: XT-IDE ADAPTER | CC-BY-SA v2 | http://dangerousprototypes.com